# Altium schematic sheet CD4060BM_硬件定时器.SchDoc
size A4
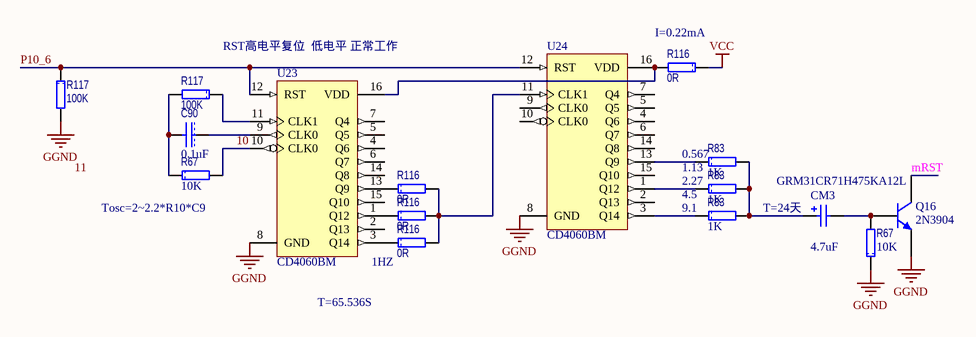
[diagram p0: CD4060BM_硬件定时器.SchDoc]

## Parts
(Parts that share a designator on the sheet are numbered #1, #2 ... from top to bottom, then left to right.)
C90  value 0.1uF  [1608[0603]C]  (hidden comment: C1608X7R1H104K)
CM3  GRM31CR71H475KA12L  value 4.7uF  [3216[1206]C]
Q16  2N3904  [SOT23_N]
R67#1  value 10K  [1608[0603]R]  (hidden comment: CRCW060310K0FKEA)
R67#2  value 10K  [1608[0603]R]  (hidden comment: CRCW060310K0FKEA)
R83#1  value 1K  [1608[0603]R]  (hidden comment: CRCW06031K00FKEA)
R83#2  value 1K  [1608[0603]R]  (hidden comment: CRCW06031K00FKEA)
R83#3  value 1K  [1608[0603]R]  (hidden comment: CRCW06031K00FKEA)
R116#1  0R  [1608[0603]R]
R116#2  0R  [1608[0603]R]
R116#3  0R  [1608[0603]R]
R116#4  0R  [1608[0603]R]
R117#1  100K  [1608[0603]R]
R117#2  100K  [1608[0603]R]
U23  CD4060BM  [SOIC16_N]
U24  CD4060BM  [SOIC16_N]

## Nets
GGND: Q16.1(E) R67#2.1 R117#1.2 U23.8(GND) U24.8(GND)
VCC: R116#1.1
10: R67#1.2 U23.10(CLK0)
mRST: Q16.3(C)
P10_6: R117#1.1 U23.12(RST) U24.12(RST)
NetC90_1: C90.1 U23.9(CLK0)
NetC90_2: C90.2 R67#1.1 R117#2.2
NetCM3_1: CM3.1 R83#1.2 R83#2.2 R83#3.2
NetCM3_2: CM3.2 Q16.2(B) R67#2.2
NetR83#1_1: R83#1.1 U24.13(Q9)
NetR83#2_1: R83#2.1 U24.1(Q12)
NetR83#3_1: R83#3.1 U24.3(Q14)
NetR116#1_2: R116#1.2 U23.16(VDD) U24.16(VDD)
NetR116#2_1: R116#2.1 U23.13(Q9)
NetR116#2_2: R116#2.2 R116#3.2 R116#4.2 U24.11(CLK1)
NetR116#3_1: R116#3.1 U23.1(Q12)
NetR116#4_1: R116#4.1 U23.3(Q14)
NetR117#2_1: R117#2.1 U23.11(CLK1)

Not connected (* = marked no-connect by the designer): U23 2(Q13) 4(Q6) 5(Q5) 6(Q7) 7(Q4) 14(Q8) 15(Q10); U24 2(Q13) 4(Q6) 5(Q5) 6(Q7) 7(Q4) 9(CLK0) 10(CLK0) 14(Q8) 15(Q10)

## Notes on the sheet
- I=0.22mA
- RST高电平复位  低电平 正常工作
- (near R83#1) 1.13
- (near R83#1) 0.567
- (near R67#1) Tosc=2~2.2*R10*C9
- (near R83#3) 9.1
- (near R83#2) 4.5
- (near R83#2) 2.27
- T=24天
- T=65.536S
- 1HZ
- Labels drawn without touching a wire or pin: 11

## Library data of the parts
C90 = CAP: 多层陶瓷电容器MLCC - SMD/SMT 0603 0.1uF 50volts X7R 10%; Manufacturer: TDK; 产品: General Type MLCCs; 产品种类: Low & Medium Capacitance SMD Ceramic Chip Capacitors; 外壳代码 - in: 0603; 外壳代码 - mm: 1608; 封装 / 箱体: 0603 (1608 metric); 封装: Reel; 尺寸: 0.8 mm W x 1.6 mm L x 0.8 mm H; 工作温度范围: - 55 C to + 125 C; 标准包装数量: 4000; 电压额定值: 50 V; 电容-nF: 100 nF; 电容-pF: 100000 pF; 系列: C; Category: 多层陶瓷电容器MLCC - SMD/SMT; ComponentLink1Description: http://www.tdk.com/pdf/general_B11.pdf; ComponentLink1URL: http://www.tdk.com/pdf/general_B11.pdf; Description 1: 多层陶瓷电容器MLCC - SMD/SMT 0603 0.1uF 50volts X7R 10%; Manufacturer Part Number: C1608X7R1H104K; Minimum Order Quantity: 1; Pricing 1: 1=0.160, 50=0.070, 100=0.036, 500=0.019, 1000=0.013, 4000=0.010, 8000=0.009, 12000=0.008, 20000=0.007 (USD); Reeling: True; RoHS - 贸泽: Y; RoHS: RoHS Compliant; Stock 1: 224604; Supplier 1: Mouser; Supplier Part Number 1: 810-C1608X7R1H104K; 制造商: TDK; 容差: 10 %; 温度系数/代码: X7R; 电容: 0.1 uF; 端接类型: SMD/SMT
CM3 = Cap Pol2: 多层陶瓷电容器MLCC - SMD/SMT 4.7uF 50Volts 10%; Manufacturer: Murata Electronics; 尺寸: 1.6 mm W x 3.2 mm L x 1.6 mm H; 工作温度范围: - 55 C to + 125 C; 封装 / 箱体: 1206 (3216 metric); 封装: Reel; 产品: General Type MLCCs; 系列: GRM; 电压额定值: 50 V; 电容-nF: 4700 nF; 外壳代码 - in: 1206; 外壳代码 - mm: 3216; 制造商: Murata; 标准包装数量: 2000; 温度系数/代码: X7R; Supplier 1: Mouser; Supplier Part Number 1: 81-GRM31CR71H475KA2L; Manufacturer Part Number: GRM31CR71H475KA12L; RoHS: RoHS Compliant; Description 1: 多层陶瓷电容器MLCC - SMD/SMT 4.7uF 50Volts 10%; Category: 多层陶瓷电容器MLCC - SMD/SMT; Stock 1: 57549; Pricing 1: 1=0.890, 10=0.561, 100=0.338, 1000=0.309, 2000=0.194, 10000=0.191, 24000=0.187, 50000=0.183 (USD); 电容: 4.7 uF; 端接类型: SMD/SMT; 容差: 10 %; RoHS - 贸泽: Y; Minimum Order Quantity: 1; Reeling: True; ComponentLink1URL: http://www.mouser.com/ds/2/281/product-244798.pdf; ComponentLink1Description: http://www.mouser.com/ds/2/281/product-244798.pdf
Q16 = 2N3904: NPN General Purpose Amplifier; Published: 8-Jun-2000; LatestRevisionDate: 15-Jan-2003; LatestRevisionNote: PCB Footprint 'BCY-W3/D4.7' replaced; DatasheetVersion: 1997; PackageVersion: Sep-1998; PackageReference: TO-92A; Publisher: Altium Limited; PackageDescription: TO, Flat Index; 3 In-Line, Axial Leads; Body Dia. 4.5mm; Leads 0.51 x 0.48 mm (max); ComponentLink1Description: Manufacturer Link; ComponentLink1URL: http://www.fairchildsemi.com/; ComponentLink2Description: Datasheet; ComponentLink2URL: http://www.fairchildsemi.com/ds/2N%2F2N3904.pdf
R67#1 R67#2 = RES: 厚膜电阻器 - SMD 1/10watt 10Kohms 1%; Manufacturer: Vishay / Dale; 尺寸: 0.85 mm W x 1.55 mm L x 0.45 mm H; 工作温度范围: - 55 C to + 155 C; 封装 / 箱体: 0603 (1608 metric); 封装: Reel; 功率额定值: 100 mW; 产品: Thick Film Resistors SMD; 系列: CRCW; 温度系数: 100 PPM / K; 端接类型: SMD/SMT; 电压额定值: 75 V; 制造商: Vishay; 产品种类: 0603 Thick Film Chip Resistors; 标准包装数量: 5000; 外壳代码 - in: 0603; 外壳代码 - mm: 1608; Supplier 1: Mouser; Supplier Part Number 1: 71-CRCW0603-10K-E3; Manufacturer Part Number: CRCW060310K0FKEA; RoHS: RoHS Compliant By Exemption; Category: 厚膜电阻器 - SMD; Stock 1: 0; Pricing 1: 1=0.080, 10=0.013, 100=0.010, 1000=0.008, 5000=0.005, 25000=0.004, 50000=0.003 (USD); 电阻: 10 kOhms; 容差: 1 %; RoHS - 贸泽: E; Minimum Order Quantity: 1; Reeling: True; ComponentLink1URL: http://www.mouser.com/ds/2/427/dcrcwe3-109170.pdf; ComponentLink1Description: http://www.mouser.com/ds/2/427/dcrcwe3-109170.pdf; Description 1: 厚膜电阻器 - SMD 1/10watt 10Kohms 1%
R83#1-R83#3 = RES: 厚膜电阻器 - SMD 1/10watt 1.0Kohms 1%; Manufacturer: Vishay / Dale; 尺寸: 0.85 mm W x 1.55 mm L x 0.45 mm H; 工作温度范围: - 55 C to + 155 C; 封装 / 箱体: 0603 (1608 metric); 封装: Reel; 功率额定值: 100 mW; 产品: Thick Film Resistors SMD; 电阻: 1 kOhms; 系列: CRCW; 温度系数: 100 PPM / K; 端接类型: SMD/SMT; 电压额定值: 75 V; 制造商: Vishay; 产品种类: 0603 Thick Film Chip Resistors; 标准包装数量: 5000; 外壳代码 - in: 0603; 外壳代码 - mm: 1608; Supplier 1: Mouser; Supplier Part Number 1: 71-CRCW0603-1.0K-E3; Manufacturer Part Number: CRCW06031K00FKEA; RoHS: RoHS Compliant By Exemption; Category: 厚膜电阻器 - SMD; Stock 1: 276938; Pricing 1: 1=0.080, 10=0.013, 100=0.010, 1000=0.008, 5000=0.005, 25000=0.004, 50000=0.003 (USD); 容差: 1 %; RoHS - 贸泽: E; Minimum Order Quantity: 1; Reeling: True; ComponentLink1URL: http://www.mouser.com/ds/2/427/dcrcwe3-109170.pdf; ComponentLink1Description: http://www.mouser.com/ds/2/427/dcrcwe3-109170.pdf; Description 1: 厚膜电阻器 - SMD 1/10watt 1.0Kohms 1%
R116#1-R116#4 = RES: Model: RT0603DRD7D0RL; 公司: vishay; Parameters: 50V 1/10W 0.5%; Type: 无铅电阻; Value: 0R
R117#1 R117#2 = RES: Model: RT0603DRD7D100KL; 公司: vishay; Parameters: 50V 1/10W 0.5%; Type: 无铅电阻; Value: 100K
U23 U24 = CD4060BCM: 14-Stage Ripple Carry Binary Counter; Published: 17-Jul-2002; LatestRevisionDate: 13-Apr-2006; LatestRevisionNote: IPC-7351 Footprint Added.; DatasheetVersion: Jan-1999; PackageVersion: 2000; PackageReference: M16A; Publisher: Altium Limited; PackageDescription: 16-Pin Small Outline Integrated Circuit 1.27 mm Pitch; Code_IPC: SOIC127P600-16; ComponentLink1Description: Manufacturer Link; ComponentLink1URL: http://www.fairchildsemi.com/; ComponentLink2Description: Datasheet; ComponentLink2URL: http://www.fairchildsemi.com/ds/CD%2FCD4040BC.pdf